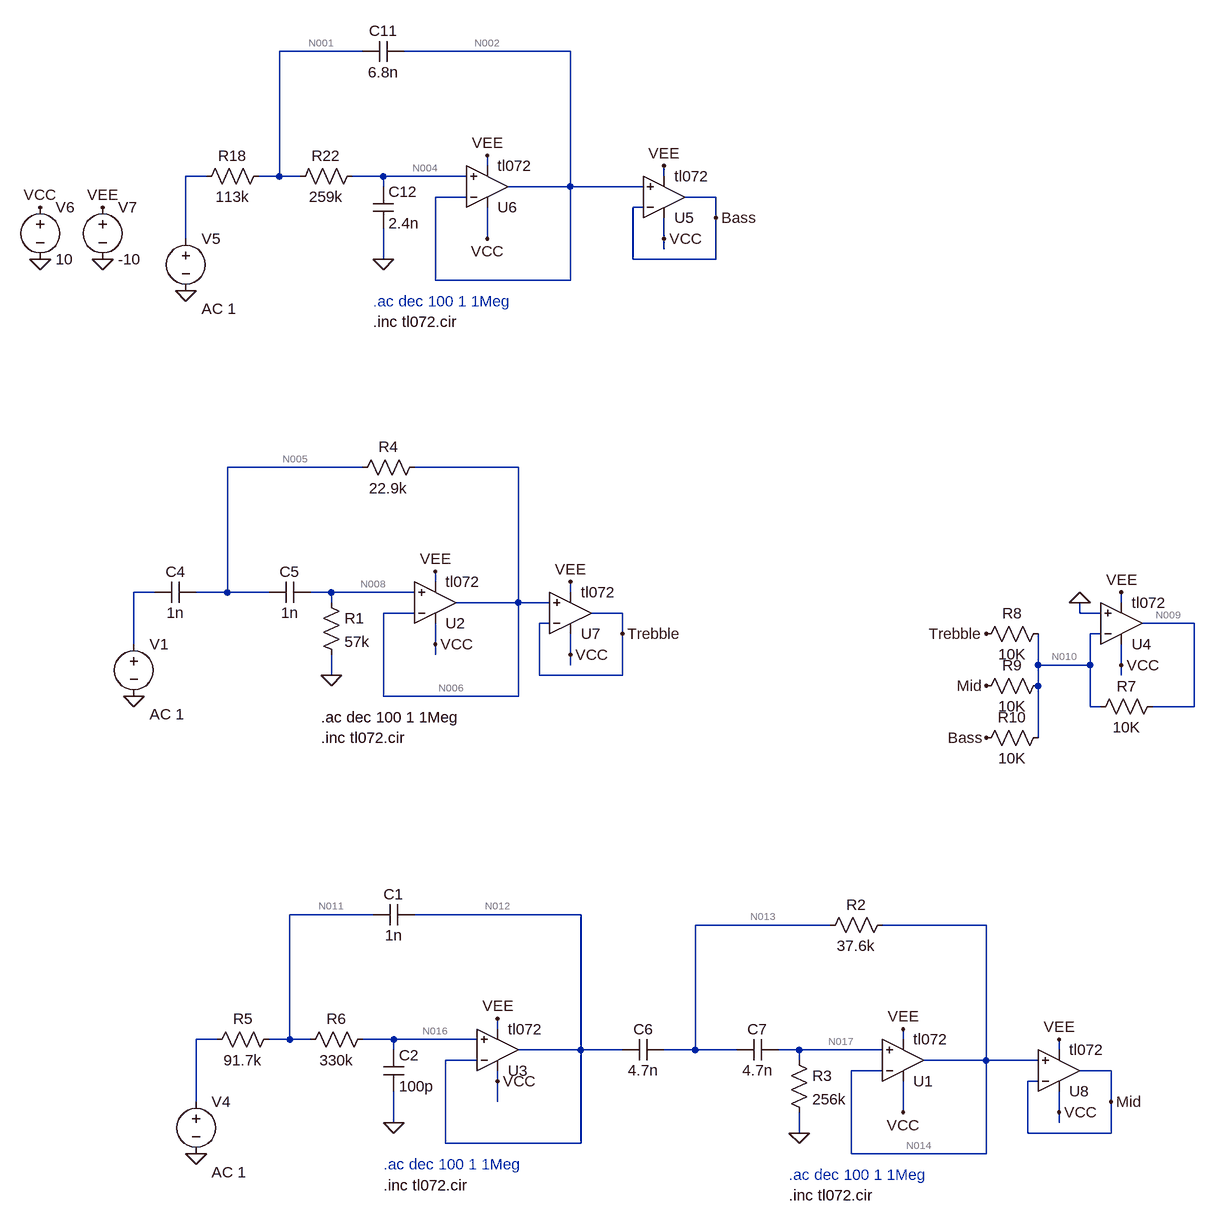
[diagram p0: schematic EQ.asc]
EQ.asc, the LTspice schematic file:
Version 4.1
SHEET 1 1376 1008
WIRE 80 -768 -48 -768
WIRE 400 -768 144 -768
WIRE 272 -592 272 -608
WIRE -160 -576 -192 -576
WIRE -48 -576 -48 -768
WIRE -48 -576 -80 -576
WIRE -16 -576 -48 -576
WIRE 112 -576 64 -576
WIRE 240 -576 112 -576
WIRE 544 -576 544 -592
WIRE 112 -560 112 -576
WIRE 400 -560 400 -768
WIRE 400 -560 304 -560
WIRE 512 -560 400 -560
WIRE 240 -544 192 -544
WIRE 624 -544 576 -544
WIRE 512 -528 496 -528
WIRE 624 -512 624 -544
WIRE -192 -480 -192 -576
WIRE 272 -480 272 -528
WIRE 544 -480 544 -512
WIRE 544 -464 544 -480
WIRE 112 -448 112 -496
WIRE 496 -448 496 -528
WIRE 624 -448 624 -512
WIRE 624 -448 496 -448
WIRE 192 -416 192 -544
WIRE 400 -416 400 -560
WIRE 400 -416 192 -416
WIRE 80 -128 -128 -128
WIRE 320 -128 160 -128
WIRE 192 48 192 32
WIRE -240 64 -272 64
WIRE -128 64 -128 -128
WIRE -128 64 -176 64
WIRE -64 64 -128 64
WIRE 32 64 0 64
WIRE 160 64 32 64
WIRE 400 64 400 48
WIRE 32 80 32 64
WIRE 320 80 320 -128
WIRE 320 80 224 80
WIRE 368 80 320 80
WIRE 1248 80 1248 64
WIRE 160 96 112 96
WIRE 480 96 432 96
WIRE 1184 96 1184 80
WIRE 1216 96 1184 96
WIRE 368 112 352 112
WIRE 1360 112 1280 112
WIRE 480 128 480 96
WIRE 1216 128 1200 128
WIRE -272 144 -272 64
WIRE 192 144 192 112
WIRE 192 160 192 144
WIRE 400 160 400 128
WIRE 400 176 400 160
WIRE 1120 176 1120 128
WIRE 1200 176 1200 128
WIRE 1200 176 1120 176
WIRE 1248 176 1248 144
WIRE 32 192 32 160
WIRE 352 192 352 112
WIRE 480 192 480 128
WIRE 480 192 352 192
WIRE 1248 192 1248 176
WIRE 1120 208 1120 176
WIRE 112 224 112 96
WIRE 320 224 320 80
WIRE 320 224 112 224
WIRE 1200 240 1200 176
WIRE 1216 240 1200 240
WIRE 1360 240 1360 112
WIRE 1360 240 1296 240
WIRE 1120 288 1120 208
WIRE 96 560 -32 560
WIRE 416 560 160 560
WIRE 800 576 592 576
WIRE 1040 576 880 576
WIRE 288 736 288 720
WIRE -144 752 -176 752
WIRE -32 752 -32 560
WIRE -32 752 -64 752
WIRE 0 752 -32 752
WIRE 128 752 80 752
WIRE 256 752 128 752
WIRE 912 752 912 736
WIRE 128 768 128 752
WIRE 416 768 416 560
WIRE 416 768 320 768
WIRE 480 768 416 768
WIRE 592 768 592 576
WIRE 592 768 544 768
WIRE 656 768 592 768
WIRE 752 768 720 768
WIRE 880 768 752 768
WIRE 1152 768 1152 752
WIRE 256 784 208 784
WIRE 752 784 752 768
WIRE 1040 784 1040 576
WIRE 1040 784 944 784
WIRE 1120 784 1040 784
WIRE 880 800 832 800
WIRE 1232 800 1184 800
WIRE 288 816 288 800
WIRE 1120 816 1104 816
WIRE -176 848 -176 752
WIRE 288 848 288 816
WIRE 1232 848 1232 800
WIRE 912 864 912 816
WIRE 1152 864 1152 832
WIRE 128 880 128 832
WIRE 1152 880 1152 864
WIRE 752 896 752 864
WIRE 1104 896 1104 816
WIRE 1232 896 1232 848
WIRE 1232 896 1104 896
WIRE 208 912 208 784
WIRE 416 912 416 768
WIRE 416 912 208 912
WIRE 832 928 832 800
WIRE 1040 928 1040 784
WIRE 1040 928 832 928
FLAG 32 192 0
FLAG -272 224 0
FLAG 112 -448 0
FLAG -192 -400 0
FLAG -416 -448 0
FLAG -320 -448 0
FLAG -416 -528 VCC
FLAG -320 -528 VEE
FLAG 752 896 0
FLAG 128 880 0
FLAG -176 928 0
FLAG 624 -512 Bass
FLAG 272 -608 VEE
FLAG 272 -480 VCC
FLAG 192 32 VEE
FLAG 192 144 VCC
FLAG 288 816 VCC
FLAG 912 864 VCC
FLAG 288 720 VEE
FLAG 1248 64 VEE
FLAG 1248 176 VCC
FLAG 1040 128 Trebble
FLAG 1040 208 Mid
FLAG 544 -592 VEE
FLAG 544 -480 VCC
FLAG 1040 288 Bass
FLAG 480 128 Trebble
FLAG 400 48 VEE
FLAG 400 160 VCC
FLAG 1152 752 VEE
FLAG 1152 864 VCC
FLAG 1232 848 Mid
FLAG 912 736 VEE
FLAG 1184 80 0
SYMBOL voltage -272 128 R0
WINDOW 123 24 124 Left 2
WINDOW 39 0 0 Left 0
SYMATTR Value2 AC 1
SYMATTR InstName V1
SYMATTR Value ""
SYMBOL OpAmps\\opamp2 192 144 M180
SYMATTR InstName U2
SYMATTR Value tl072
SYMBOL res 176 -144 R90
WINDOW 0 0 56 VBottom 2
WINDOW 3 32 56 VTop 2
SYMATTR InstName R4
SYMATTR Value 22.9k
SYMBOL cap -176 48 R90
WINDOW 0 0 32 VBottom 2
WINDOW 3 32 32 VTop 2
SYMATTR InstName C4
SYMATTR Value 1n
SYMBOL cap 0 48 R90
WINDOW 0 0 32 VBottom 2
WINDOW 3 32 32 VTop 2
SYMATTR InstName C5
SYMATTR Value 1n
SYMBOL res 16 64 R0
SYMATTR InstName R1
SYMATTR Value 57k
SYMBOL voltage -192 -496 R0
WINDOW 123 24 124 Left 2
WINDOW 39 0 0 Left 0
SYMATTR Value2 AC 1
SYMATTR InstName V5
SYMATTR Value ""
SYMBOL voltage -416 -544 R0
WINDOW 123 0 0 Left 0
WINDOW 39 0 0 Left 0
SYMATTR InstName V6
SYMATTR Value 10
SYMBOL voltage -320 -544 R0
WINDOW 123 0 0 Left 0
WINDOW 39 0 0 Left 0
SYMATTR InstName V7
SYMATTR Value -10
SYMBOL OpAmps\\opamp2 272 -496 M180
SYMATTR InstName U6
SYMATTR Value tl072
SYMBOL res -64 -592 R90
WINDOW 0 0 56 VBottom 2
WINDOW 3 32 56 VTop 2
SYMATTR InstName R18
SYMATTR Value 113k
SYMBOL res 80 -592 R90
WINDOW 0 0 56 VBottom 2
WINDOW 3 32 56 VTop 2
SYMATTR InstName R22
SYMATTR Value 259k
SYMBOL cap 144 -784 R90
WINDOW 0 0 32 VBottom 2
WINDOW 3 32 32 VTop 2
SYMATTR InstName C11
SYMATTR Value 6.8n
SYMBOL cap 96 -560 R0
SYMATTR InstName C12
SYMATTR Value 2.4n
SYMBOL OpAmps\\opamp2 912 848 M180
SYMATTR InstName U1
SYMATTR Value tl072
SYMBOL res 896 560 R90
WINDOW 0 0 56 VBottom 2
WINDOW 3 32 56 VTop 2
SYMATTR InstName R2
SYMATTR Value 37.6k
SYMBOL cap 544 752 R90
WINDOW 0 0 32 VBottom 2
WINDOW 3 32 32 VTop 2
SYMATTR InstName C6
SYMATTR Value 4.7n
SYMBOL cap 720 752 R90
WINDOW 0 0 32 VBottom 2
WINDOW 3 32 32 VTop 2
SYMATTR InstName C7
SYMATTR Value 4.7n
SYMBOL res 736 768 R0
SYMATTR InstName R3
SYMATTR Value 256k
SYMBOL voltage -176 832 R0
WINDOW 123 24 124 Left 2
WINDOW 39 0 0 Left 0
SYMATTR Value2 AC 1
SYMATTR InstName V4
SYMATTR Value ""
SYMBOL OpAmps\\opamp2 288 832 M180
SYMATTR InstName U3
SYMATTR Value tl072
SYMBOL res -48 736 R90
WINDOW 0 0 56 VBottom 2
WINDOW 3 32 56 VTop 2
SYMATTR InstName R5
SYMATTR Value 91.7k
SYMBOL res 96 736 R90
WINDOW 0 0 56 VBottom 2
WINDOW 3 32 56 VTop 2
SYMATTR InstName R6
SYMATTR Value 330k
SYMBOL cap 160 544 R90
WINDOW 0 0 32 VBottom 2
WINDOW 3 32 32 VTop 2
SYMATTR InstName C1
SYMATTR Value 1n
SYMBOL cap 112 768 R0
SYMATTR InstName C2
SYMATTR Value 100p
SYMBOL OpAmps\\opamp2 1248 176 M180
SYMATTR InstName U4
SYMATTR Value tl072
SYMBOL res 1312 224 R90
WINDOW 0 0 56 VBottom 2
WINDOW 3 32 56 VTop 2
SYMATTR InstName R7
SYMATTR Value 10K
SYMBOL res 1136 112 R90
WINDOW 0 0 56 VBottom 2
WINDOW 3 32 56 VTop 2
SYMATTR InstName R8
SYMATTR Value 10K
SYMBOL res 1136 192 R90
WINDOW 0 0 56 VBottom 2
WINDOW 3 32 56 VTop 2
SYMATTR InstName R9
SYMATTR Value 10K
SYMBOL res 1136 272 R90
WINDOW 0 0 56 VBottom 2
WINDOW 3 32 56 VTop 2
SYMATTR InstName R10
SYMATTR Value 10K
SYMBOL OpAmps\\opamp2 544 -480 M180
SYMATTR InstName U5
SYMATTR Value tl072
SYMBOL OpAmps\\opamp2 400 160 M180
SYMATTR InstName U7
SYMATTR Value tl072
SYMBOL OpAmps\\opamp2 1152 864 M180
SYMATTR InstName U8
SYMATTR Value tl072
TEXT 16 288 Left 2 !.inc tl072.cir
TEXT 16 256 Left 2 !.ac dec 100 1 1Meg
TEXT 96 -352 Left 2 !.inc tl072.cir
TEXT 96 -384 Left 2 ;.ac dec 100 1 1Meg
TEXT 736 992 Left 2 !.inc tl072.cir
TEXT 736 960 Left 2 ;.ac dec 100 1 1Meg
TEXT 112 976 Left 2 !.inc tl072.cir
TEXT 112 944 Left 2 ;.ac dec 100 1 1Meg

The netlist it stands for:
* EQ.asc
V1 N007 0 AC 1
X§U2 N008 N006 VCC VEE N006 tl072  ; pins In+ In- V+ V- OUT
R4 N006 N005 22.9k
C4 N005 N007 1n
C5 N008 N005 1n
R1 N008 0 57k
V5 N003 0 AC 1
V6 VCC 0 10
V7 VEE 0 -10
X§U6 N004 N002 VCC VEE N002 tl072  ; pins In+ In- V+ V- OUT
R18 N001 N003 113k
R22 N004 N001 259k
C11 N002 N001 6.8n
C12 N004 0 2.4n
X§U1 N017 N014 VCC VEE N014 tl072  ; pins In+ In- V+ V- OUT
R2 N014 N013 37.6k
C6 N013 N012 4.7n
C7 N017 N013 4.7n
R3 N017 0 256k
V4 N015 0 AC 1
X§U3 N016 N012 VCC VEE N012 tl072  ; pins In+ In- V+ V- OUT
R5 N011 N015 91.7k
R6 N016 N011 330k
C1 N012 N011 1n
C2 N016 0 100p
X§U4 0 N010 VCC VEE N009 tl072  ; pins In+ In- V+ V- OUT
R7 N009 N010 10K
R8 N010 Trebble 10K
R9 N010 Mid 10K
R10 N010 Bass 10K
X§U5 N002 Bass VCC VEE Bass tl072  ; pins In+ In- V+ V- OUT
X§U7 N006 Trebble VCC VEE Trebble tl072  ; pins In+ In- V+ V- OUT
X§U8 N014 Mid VCC VEE Mid tl072  ; pins In+ In- V+ V- OUT
.inc tl072.cir
.ac dec 100 1 1Meg
.inc tl072.cir
* .ac dec 100 1 1Meg
.inc tl072.cir
* .ac dec 100 1 1Meg
.inc tl072.cir
* .ac dec 100 1 1Meg
.backanno
.end

* Results of the author's LTspice run, read from the files saved beside the schematic
* Operating Point, zero values left out:
*   V(bass) = 7.042 µV
*   V(mid) = 11.69 µV
*   V(n001) = -4.526 µV
*   V(n002) = -3.929 µV
*   V(n004) = -14.9 µV
*   V(n005) = 8.688 µV
*   V(n006) = 8.688 µV
*   V(n008) = -2.283 µV
*   V(n009) = 5.895 µV
*   V(n010) = 10.97 µV
*   V(n011) = -3.673 µV
*   V(n012) = -5.919 µV
*   V(n013) = 717.4 nV
*   V(n014) = 717.4 nV
*   V(n016) = -16.89 µV
*   V(n017) = -10.25 µV
*   V(trebble) = 19.66 µV
*   V(vcc) = 10 V
*   V(vee) = -10 V
*   I(R1) = -40.05 pA
*   I(R10) = 392.9 pA
*   I(R18) = -40.05 pA
*   I(R22) = -40.05 pA
*   I(R3) = -40.05 pA
*   I(R5) = -40.05 pA
*   I(R6) = -40.05 pA
*   I(R7) = -507.6 pA
*   I(R8) = -868.7 pA
*   I(R9) = -71.73 pA
*   I(V4) = -40.05 pA
*   I(V5) = -40.05 pA
*   I(V6) = -76.22 mA
*   I(V7) = 76.22 mA
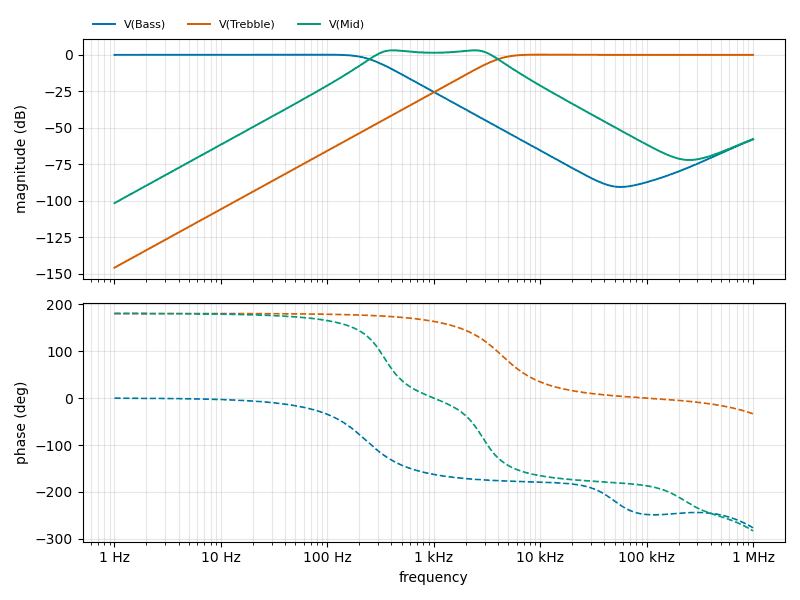
[diagram p1: AC Analysis of EQ.asc, plotted from the saved traces]
* AC Analysis, 1 run:
*   V(Bass): -0.00 dB at 1 Hz, -57.86 dB at 1 MHz, peak 0.12 dB at 93.33 Hz, 3 dB below the peak at 247.1 Hz
*   V(Trebble): -145.76 dB at 1 Hz, 0.00 dB at 1 MHz, peak 0.16 dB at 10 kHz, 3 dB below the peak at 4.055 kHz
*   V(Mid): -101.52 dB at 1 Hz, -57.63 dB at 1 MHz, peak 3.12 dB at 2.399 kHz, 3 dB below the peak at 291.3 Hz and 3.425 kHz